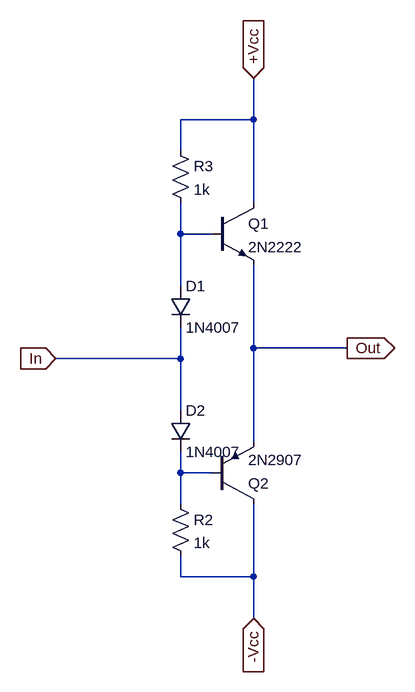
[diagram p0: schematic BipolarBuffer.asc]
BipolarBuffer.asc, the LTspice schematic file:
Version 4
SHEET 1 880 680
WIRE 224 -288 224 -352
WIRE 224 -288 112 -288
WIRE 112 -240 112 -288
WIRE 224 -160 224 -288
WIRE 112 -112 112 -160
WIRE 160 -112 112 -112
WIRE 112 -32 112 -112
WIRE 224 64 224 -64
WIRE 368 64 224 64
WIRE 112 80 112 32
WIRE 112 80 -80 80
WIRE 112 160 112 80
WIRE 224 208 224 64
WIRE 112 256 112 224
WIRE 160 256 112 256
WIRE 112 304 112 256
WIRE 112 416 112 384
WIRE 224 416 224 304
WIRE 224 416 112 416
WIRE 224 480 224 416
FLAG 224 -352 +Vcc
IOPIN 224 -352 In
FLAG 224 480 -Vcc
IOPIN 224 480 In
FLAG 368 64 Out
IOPIN 368 64 Out
FLAG -80 80 In
IOPIN -80 80 In
SYMBOL npn 160 -160 R0
SYMATTR InstName Q1
SYMATTR Value 2N2222
SYMBOL pnp 160 304 M180
SYMATTR InstName Q2
SYMATTR Value 2N2907
SYMBOL diode 96 -32 R0
SYMATTR InstName D1
SYMATTR Value 1N4007
SYMBOL diode 96 160 R0
SYMATTR InstName D2
SYMATTR Value 1N4007
SYMBOL res 96 288 R0
SYMATTR InstName R2
SYMATTR Value 1k
SYMBOL res 96 -256 R0
SYMATTR InstName R3
SYMATTR Value 1k

The netlist it stands for:
* BipolarBuffer.asc
Q1 +Vcc N001 Out 0 2N2222
Q2 -Vcc N002 Out 0 2N2907
D1 N001 In 1N4007
D2 In N002 1N4007
R2 N002 -Vcc 1k
R3 +Vcc N001 1k
.model D D
.lib standard.dio
.model NPN NPN
.model PNP PNP
.lib standard.bjt
.backanno
.end